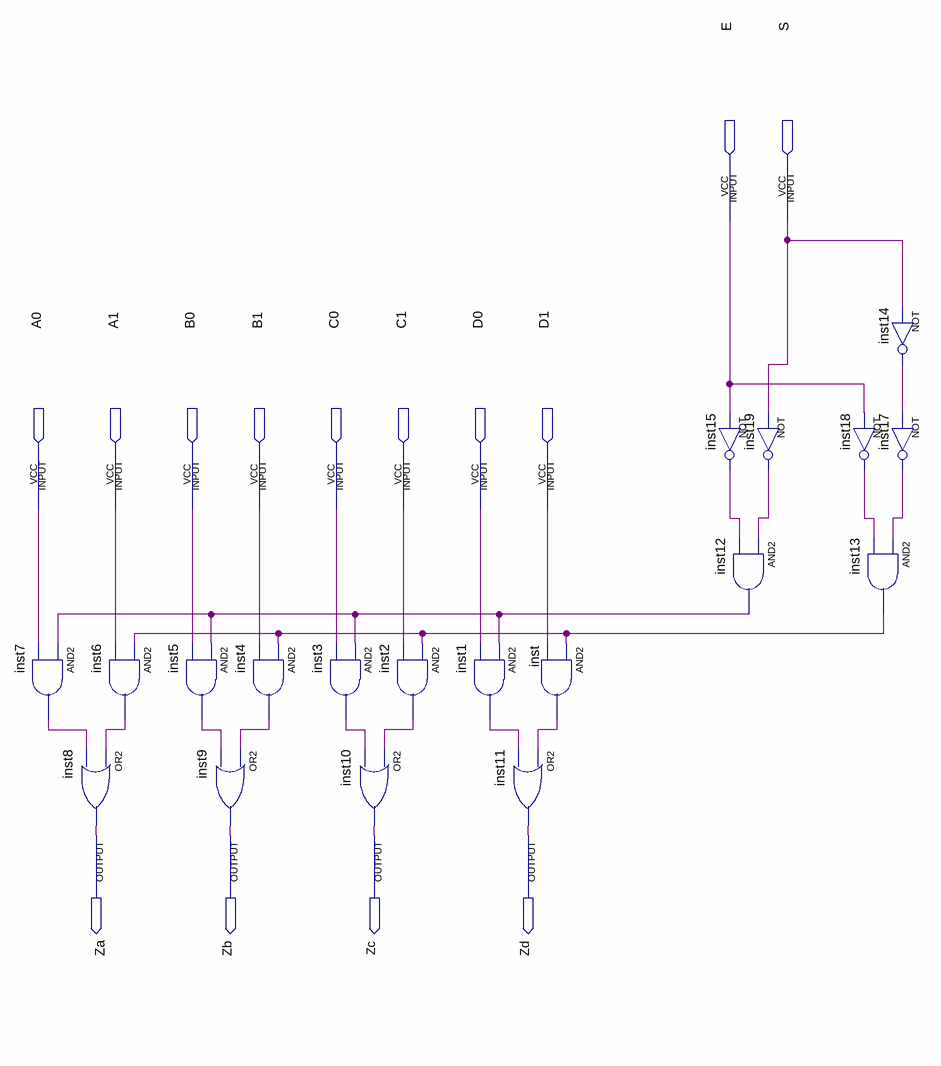
[diagram p0: schematic sheet]
// Quartus schematic ci74157.bdf as structural Verilog: 19 symbols, 14 pins
module ci74157 (
  input  E,
  input  S,
  input  A0,
  input  A1,
  input  B0,
  input  B1,
  input  C0,
  input  C1,
  input  D0,
  input  D1,
  output Za,
  output Zb,
  output Zc,
  output Zd
);

  wire inst1_out, inst2_out, inst3_out, inst4_out, inst5_out, inst6_out, inst7_out, inst12_out, inst13_out,
       inst14_out, inst15_out, inst17_out, inst18_out, inst19_out, inst_out;

  and inst7 (inst7_out, inst12_out, A0);
  and inst6 (inst6_out, inst13_out, A1);
  or inst8 (Za, inst6_out, inst7_out);
  and inst5 (inst5_out, inst12_out, B0);
  and inst4 (inst4_out, inst13_out, B1);
  or inst9 (Zb, inst4_out, inst5_out);
  and inst3 (inst3_out, inst12_out, C0);
  and inst2 (inst2_out, inst13_out, C1);
  or inst10 (Zc, inst2_out, inst3_out);
  and inst1 (inst1_out, inst12_out, D0);
  and inst (inst_out, inst13_out, D1);
  or inst11 (Zd, inst_out, inst1_out);
  not inst15 (inst15_out, E);
  and inst12 (inst12_out, inst19_out, inst15_out);
  not inst19 (inst19_out, S);
  not inst18 (inst18_out, E);
  and inst13 (inst13_out, inst17_out, inst18_out);
  not inst14 (inst14_out, S);
  not inst17 (inst17_out, inst14_out);
endmodule
